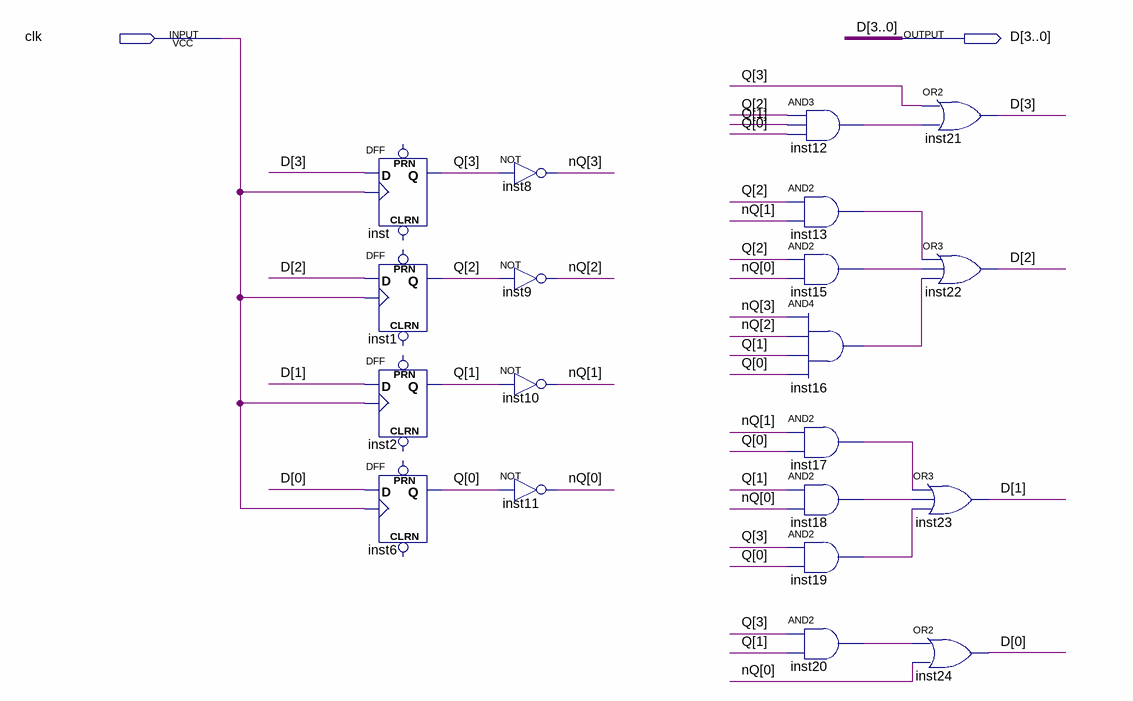
[diagram p0: schematic sheet]
// Quartus schematic upcounter.bdf as structural Verilog: 20 symbols, 2 pins
module upcounter (
  input  clk,
  output [3:0] D
);

  wire inst12_out, inst13_out, inst15_out, inst16_out, inst17_out, inst18_out, inst19_out, inst20_out;
  wire [3:0] nQ, Q;

  DFF inst (.CLK(clk), .D(D[3]), .Q(Q[3]));  // open: CLRN, PRN
  DFF inst1 (.CLK(clk), .D(D[2]), .Q(Q[2]));  // open: CLRN, PRN
  DFF inst2 (.CLK(clk), .D(D[1]), .Q(Q[1]));  // open: CLRN, PRN
  DFF inst6 (.CLK(clk), .D(D[0]), .Q(Q[0]));  // open: CLRN, PRN
  not inst8 (nQ[3], Q[3]);
  not inst9 (nQ[2], Q[2]);
  not inst10 (nQ[1], Q[1]);
  not inst11 (nQ[0], Q[0]);
  and inst12 (inst12_out, Q[2], Q[1], Q[0]);
  and inst13 (inst13_out, Q[2], nQ[1]);
  and inst15 (inst15_out, Q[2], nQ[0]);
  and inst16 (inst16_out, nQ[3], nQ[2], Q[1], Q[0]);
  and inst17 (inst17_out, nQ[1], Q[0]);
  and inst18 (inst18_out, Q[1], nQ[0]);
  and inst19 (inst19_out, Q[3], Q[0]);
  and inst20 (inst20_out, Q[3], Q[1]);
  or inst21 (D[3], Q[3], inst12_out);
  or inst22 (D[2], inst13_out, inst15_out, inst16_out);
  or inst23 (D[1], inst17_out, inst18_out, inst19_out);
  or inst24 (D[0], inst20_out, nQ[0]);
endmodule
